# EAGLE design driver_board_one_module (EAGLE 8.1.1)
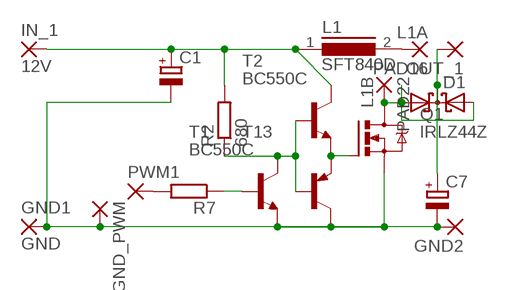
[diagram p0: schematic, sheet 1]

## Parts
C1  CPOL-EUE5-8.5  [E5-8,5]
C7  CPOL-EUE5-8.5  [E5-8,5]
D1  DIODE_2SCHOTTKY-SOT93V  [SOT93S]
GND1  GND  3,81/1,3  [3,81/1,3]
GND2  3,81/1,3  [3,81/1,3]
GND_PWM  2,54/0,8  [2,54/0,8]
IN_1  12V  3,81/1,3  [3,81/1,3]
L1  SFT840D  [SFT840D]
OUT_1  3,81/1,3  [3,81/1,3]
PAD16  L1A  3,81/1,1  [3,81/1,1]
PAD22  L1B  3,81/1,1  [3,81/1,1]
PWM1  2,54/0,8  [2,54/0,8]
Q1  IRLZ44Z  [TO220BH]
R2  680  R-EU_0204/7  [0204/7]
R7  R-EU_0207/7  [0207/7]
T1  BC550C  [TO92-EBC]
T2  BC550C  [TO92-EBC]
T13  BC557C-PNP-TO92-EBC  [TO92-EBC]

## Nets
N$1: Q1.G T2.E T13.E
N$7: R2.1 T1.C T2.B T13.B
N$13: C1.- C7.- GND1.1(P) GND2.1(P) GND_PWM.1(P) Q1.S T1.E T13.C
N$14: PWM1.1(P) R7.2
N$20: R7.1 T1.B
N$25: C1.+ IN_1.1(P) L1.1 R2.2 T2.C
N$33: L1.2 PAD16.1(P)
N$34: D1.A1 D1.A2 PAD22.1(P) Q1.D
N$35: C7.+ D1.C OUT_1.1(P)

## Library data of the parts
C1 C7 = rcl:CPOL-EU: POLARIZED CAPACITOR, European symbol
D1 = diode:DIODE_2SCHOTTKY-: Dual SCHOTTKY DIODE common cathode
GND1 GND2 IN_1 OUT_1 = wirepad:3,81/1,3: THROUGH-HOLE PAD
GND_PWM PWM1 = wirepad:2,54/0,8: THROUGH-HOLE PAD
L1 = inductors:SFT840D: INDUCTOR
PAD16 PAD22 = wirepad:3,81/1,1: THROUGH-HOLE PAD
Q1 = transistor-power:IRLZ44Z: N-Channel HEXFET® Power MOSFET Logic Level AUTOMOTIVE MOSFET Source: http://www.irf.com/product-info/datasheets/data/irlz44zpbf.pdf
R2 R7 = resistor:R-EU_: RESISTOR, European symbol
T1 T2 = transistor-npn:BC550*: NPN Transistor
T13 = transistor:*-PNP-: PNP Transistror

## Board
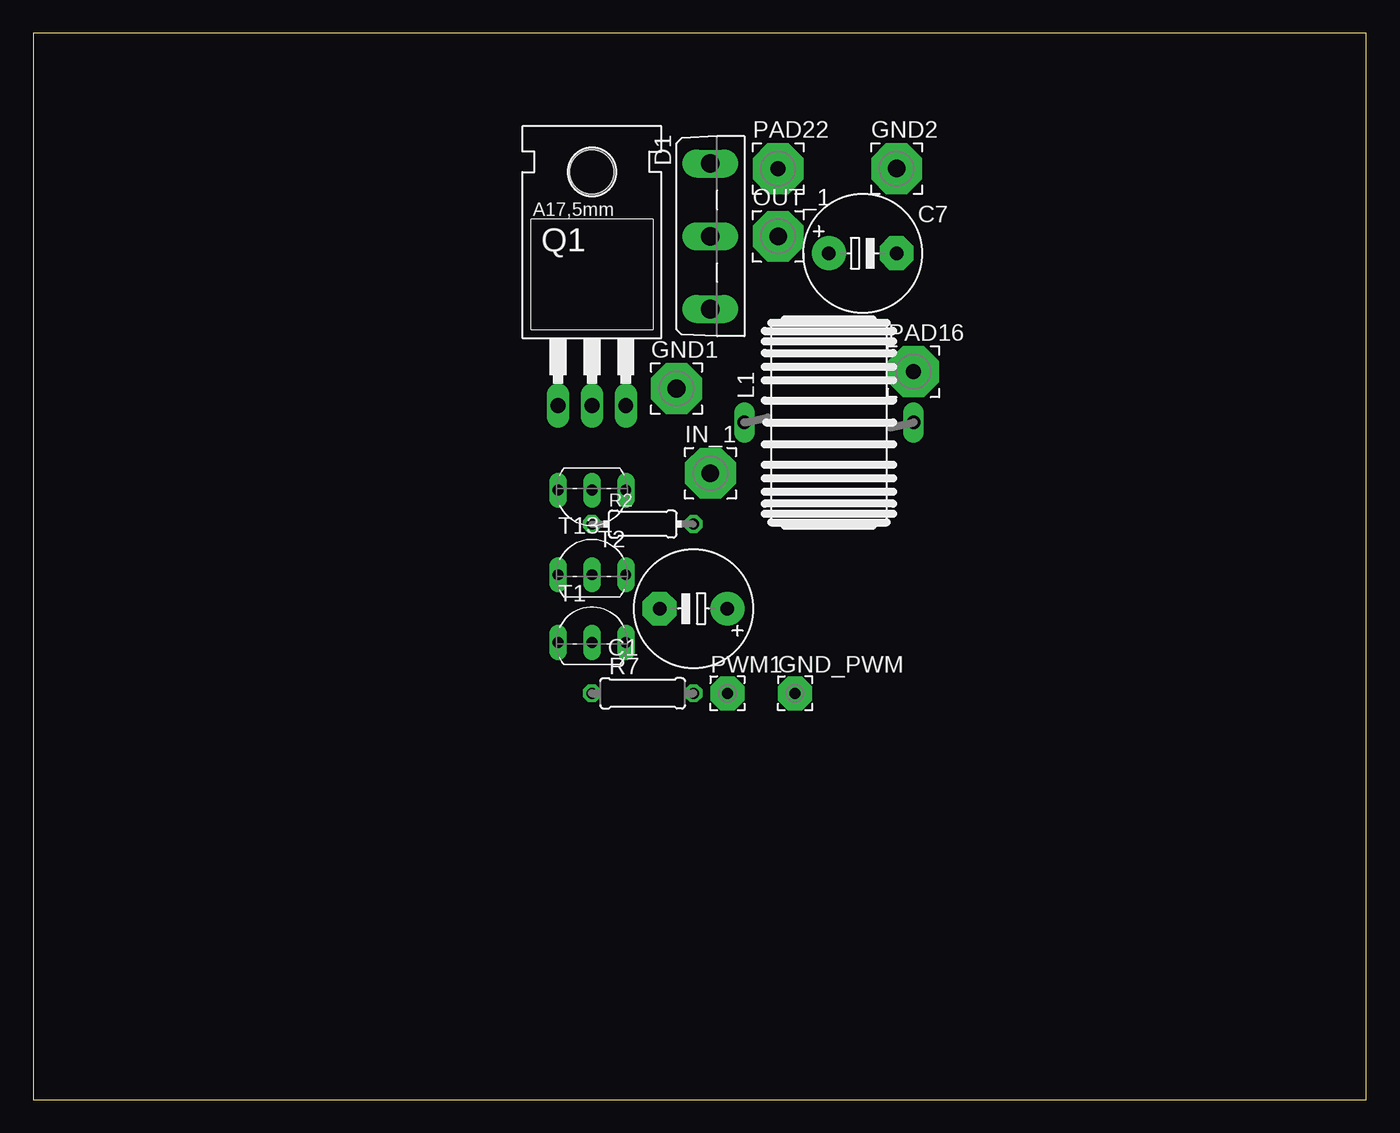
[diagram p1: board, top side]
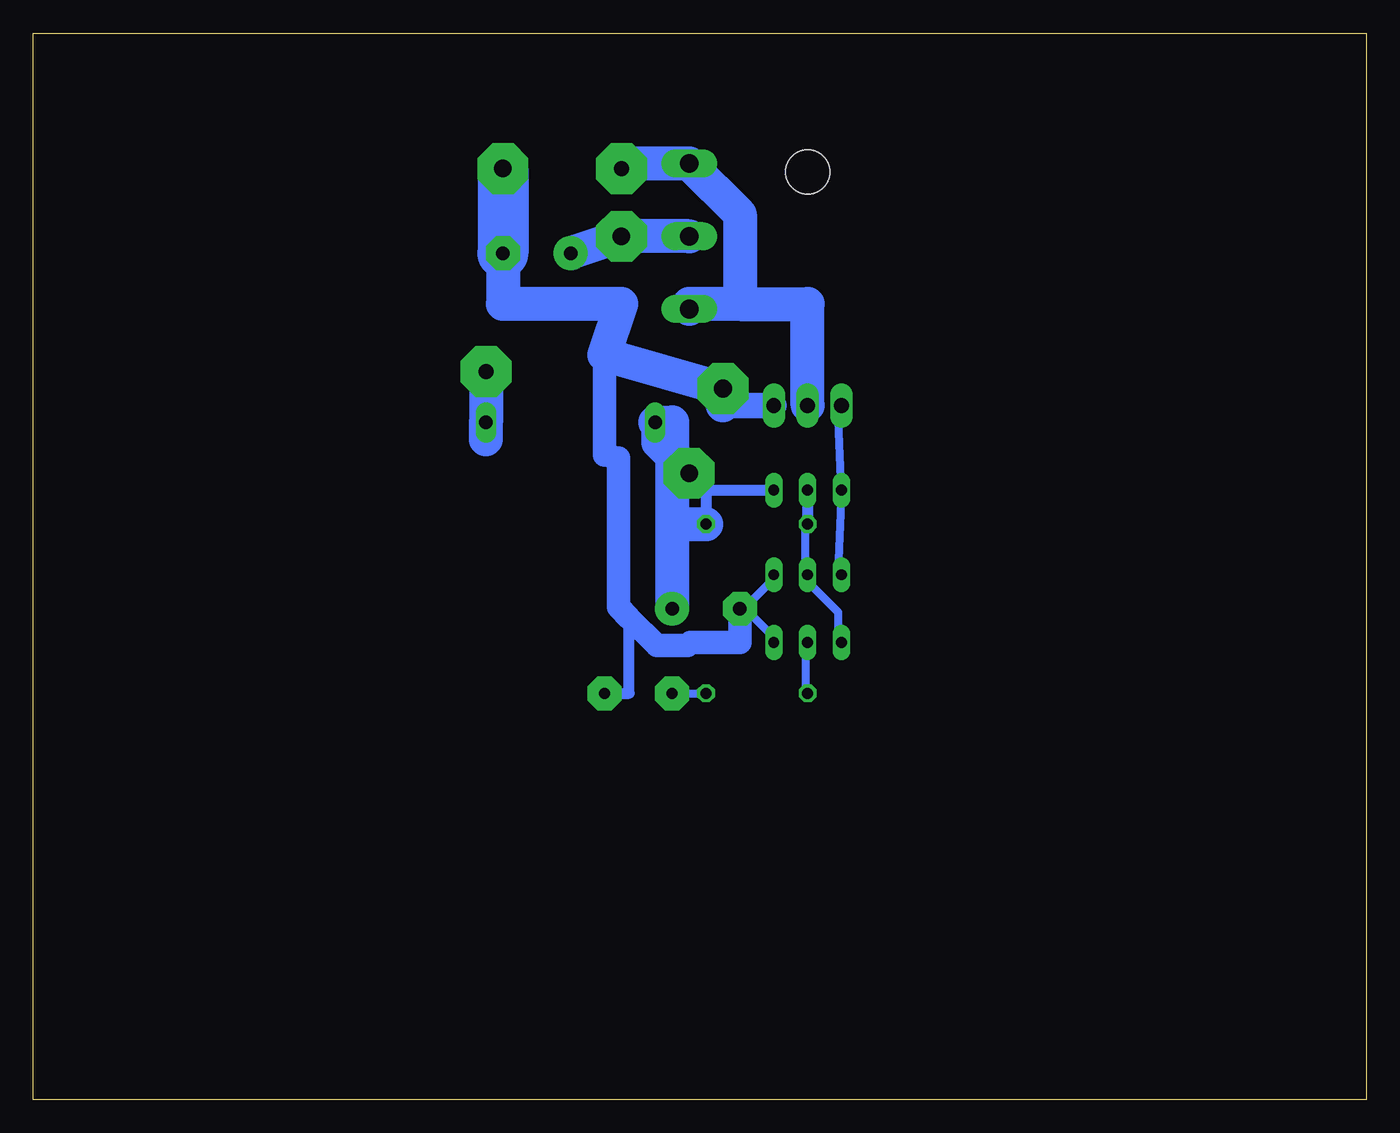
[diagram p2: board, bottom side, seen from below]

Size 100 x 80 mm. Coordinates in mm from the lower left corner, seen from the top.
Outline: 0,0 100,0 100,80 0,80 0,0
Copper layers (1*16): Top 0.035mm / dielectric 1.5mm / Bottom 0.035mm
Design rules "default *": minimum track width 24mil, minimum drill 24mil, track to track 24mil, track to pad 18mil, pad to pad 8mil, via to via 8mil, smd to smd 8mil, copper to edge 0mil, drill to drill 8mil, minimum pad ring 10mil, minimum via ring 8mil, stop-mask expansion 4mil, vias tented up to drill 0mil, thermal gap 10mil

### Footprints (pad centres in the part's own frame; a part is rotated, then mirrored left to right if it is on the bottom)
E5-8,5 = drill 1.016 pad 2.54: + -2.54,0 | drill 1.016 pad 2.54 octagon: - 2.54,0
SOT93S = drill 1.397 long: A1 -5.461,-2.54; A2 5.461,-2.54; C 0,-2.54
3,81/1,3 = drill 1.321 pad 3.81 octagon: 1 0,0
2,54/0,8 = drill 0.813 pad 2.54 octagon: 1 0,0
SFT840D = drill 1.016 long: 1 -6.35,0; 2 6.35,0
3,81/1,1 = drill 1.118 pad 3.81 octagon: 1 0,0
TO220BH = drill 1.118 long: D 0,-6.35; G -2.54,-6.35; S 2.54,-6.35 | hole 3.302: 0,11.176
0204/7 = drill 0.813 octagon: 1 -3.81,0; 2 3.81,0
0207/7 = drill 0.813 octagon: 1 -3.81,0; 2 3.81,0
TO92-EBC = drill 0.813 long: B 0,-1.27; C -2.54,-1.27; E 2.54,-1.27
TO92-EBC' = drill 0.813 long: B 0,-1.27; C 2.54,-1.27; E -2.54,-1.27

### Placement (x,y rotation side)
C1  49.53,36.83 180 top
C7  62.23,63.5 0 top
D1  53.34,64.77 270 top
GND1  48.26,53.34 0 top
GND2  64.77,69.85 0 top
GND_PWM  57.15,30.48 0 top
IN_1  50.8,46.99 0 top
L1  59.69,50.8 0 top
OUT_1  55.88,64.77 0 top
PAD16  66.04,54.61 0 top
PAD22  55.88,69.85 0 top
PWM1  52.07,30.48 0 top
Q1  41.91,58.42 0 top
R2  45.72,43.18 0 top
R7  45.72,30.48 0 top
T1  41.91,35.56 0 top
T2  41.91,44.45 180 top
T13  [TO92-EBC']  41.91,40.64 0 top

### Tracks (layer width: path | path; a pad name or v marks a point on that pad's centre or on a via)
N$1
  Bottom 0.61: T13.E 39.62,39.62 T2.E 39.62,51.82 Q1.G
N$7
  Bottom 0.61: T1.C 39.62,34.75 39.62,36.58 42.06,39.01 T13.B 42.06,39.62 42.06,42.67 R2.1
  Bottom 0.813: T2.B R2.1
N$13
  Bottom 0.61: T1.E 44.5,34.75 46.94,37.19 C1.- 46.94,36.58 44.5,39.01 T13.C 44.5,39.62
  Bottom 0.813: GND_PWM.1 55.3,30.48 55.3,36.14
  Bottom 1.778: C1.- 46.99,34.29 50.7,34.29 50.92,34.06 53.22,34.06 55.3,36.14 56.11,36.95 56.11,48.14 57.15,48.37 57.15,55.88
  Bottom 1.93: Q1.S 48.26,52.07
  Bottom 2.54: 48.26,52.07 GND1.1 57.15,55.88 55.88,59.69 64.77,59.69 C7.-
  Bottom 3.81: GND2.1 C7.-
N$14
  Bottom 0.61: PWM1.1 R7.2
N$20
  Bottom 0.61: R7.1 42.06,30.48 42.06,34.14 T1.B
N$25
  Bottom 0.813: 49.53,45.72 T2.C | 49.53,45.72 R2.2 | IN_1.1 49.53,46.99 49.53,45.72
  Bottom 2.54: 52.07,43.18 R2.2 | 52.07,43.18 C1.+ | IN_1.1 53.11,49.3 53.11,50.8 | L1.1 52.07,50.8 52.07,43.18
N$33
  Bottom 2.54: PAD16.1 L1.2 66.04,49.53
N$34
  Bottom 2.54: Q1.D 41.91,59.69 46.99,59.69 | 46.99,59.69 50.8,59.69 D1.A2 | 46.99,59.69 46.99,66.42 D1.A1 55.88,70.23 PAD22.1
N$35
  Bottom 2.54: D1.C OUT_1.1 C7.+